# EasyEDA Pro project drive.epro, board PCB2
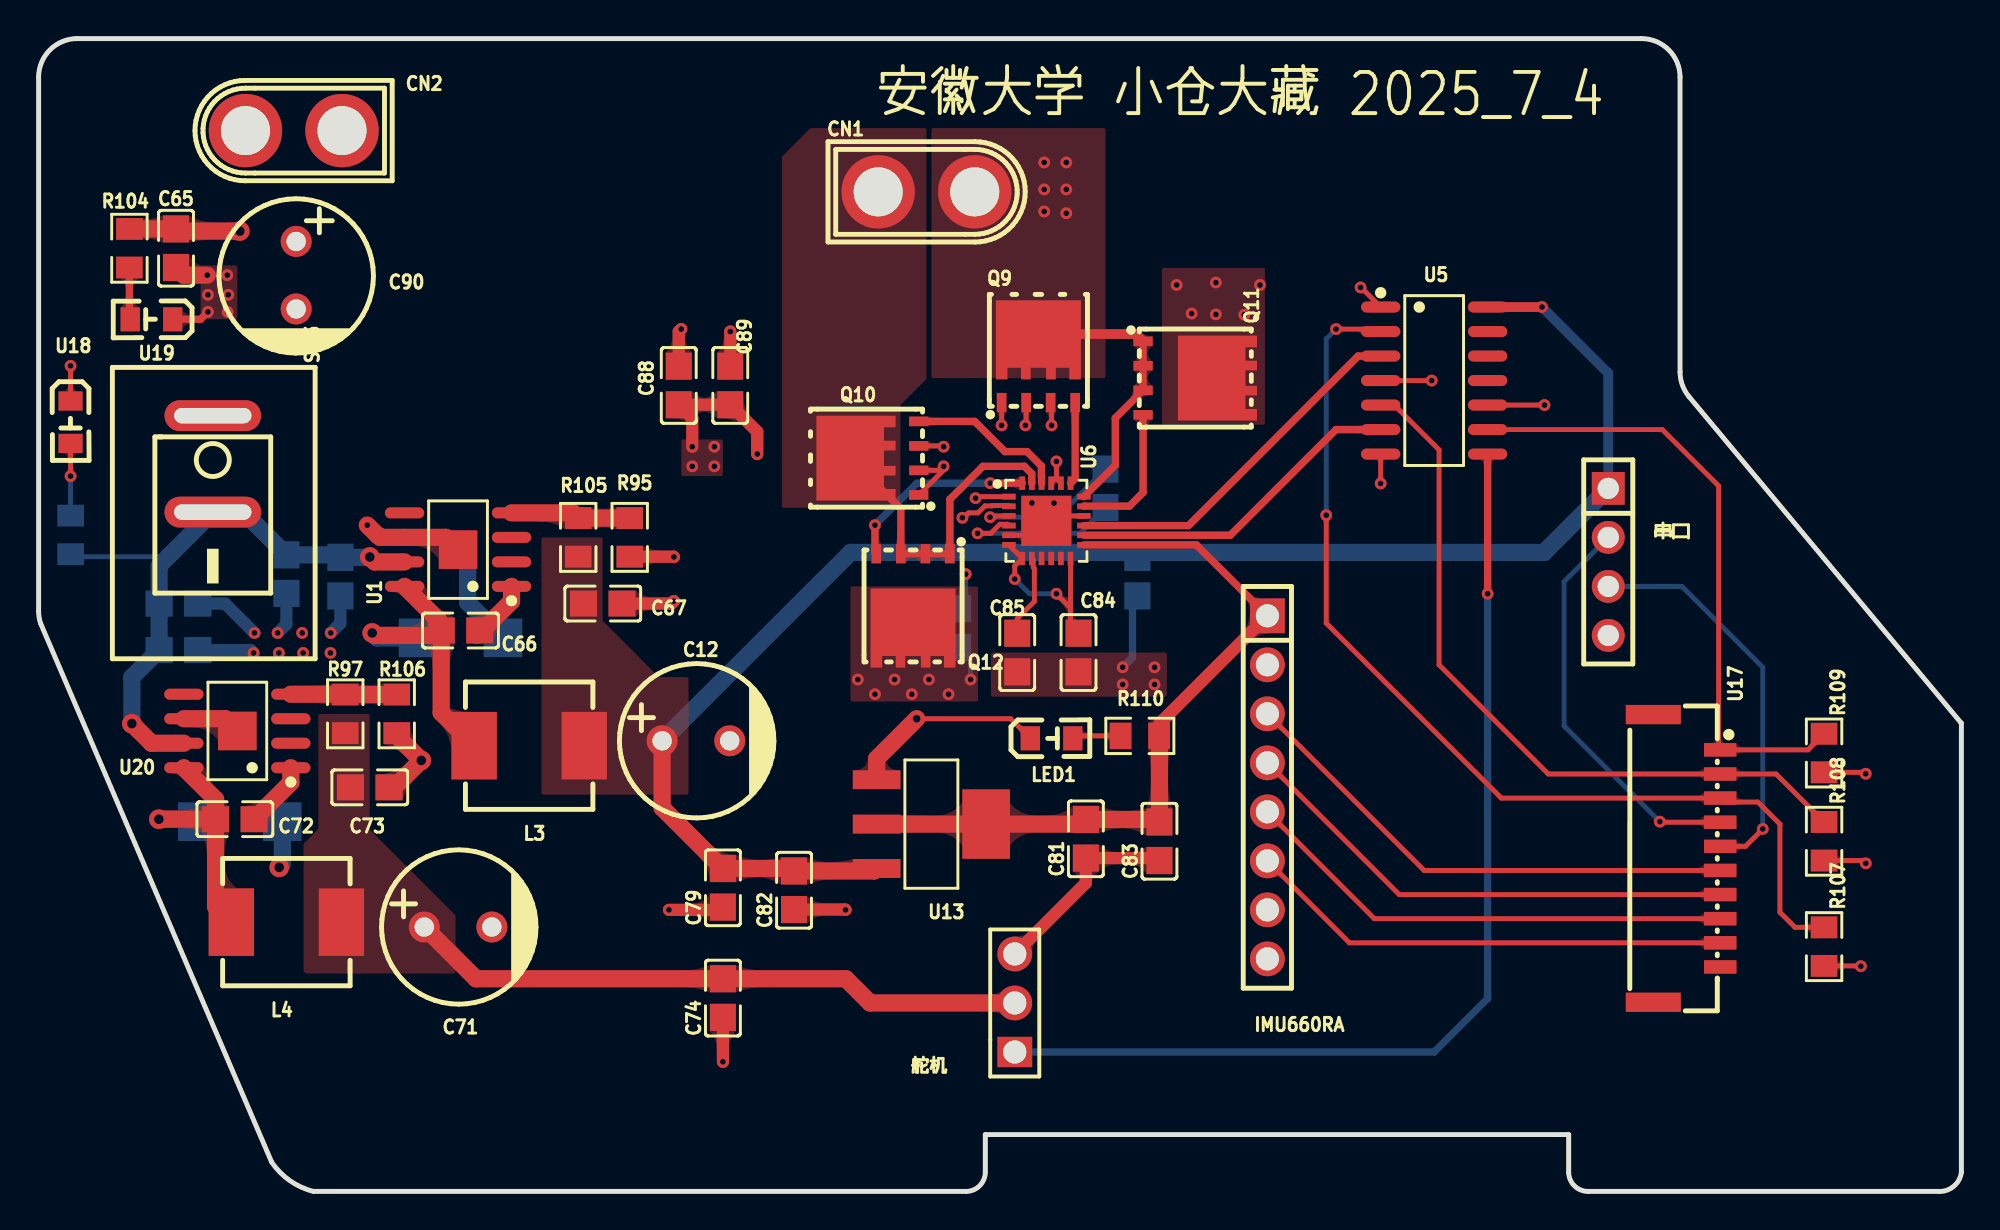
[diagram p4: board, top side]
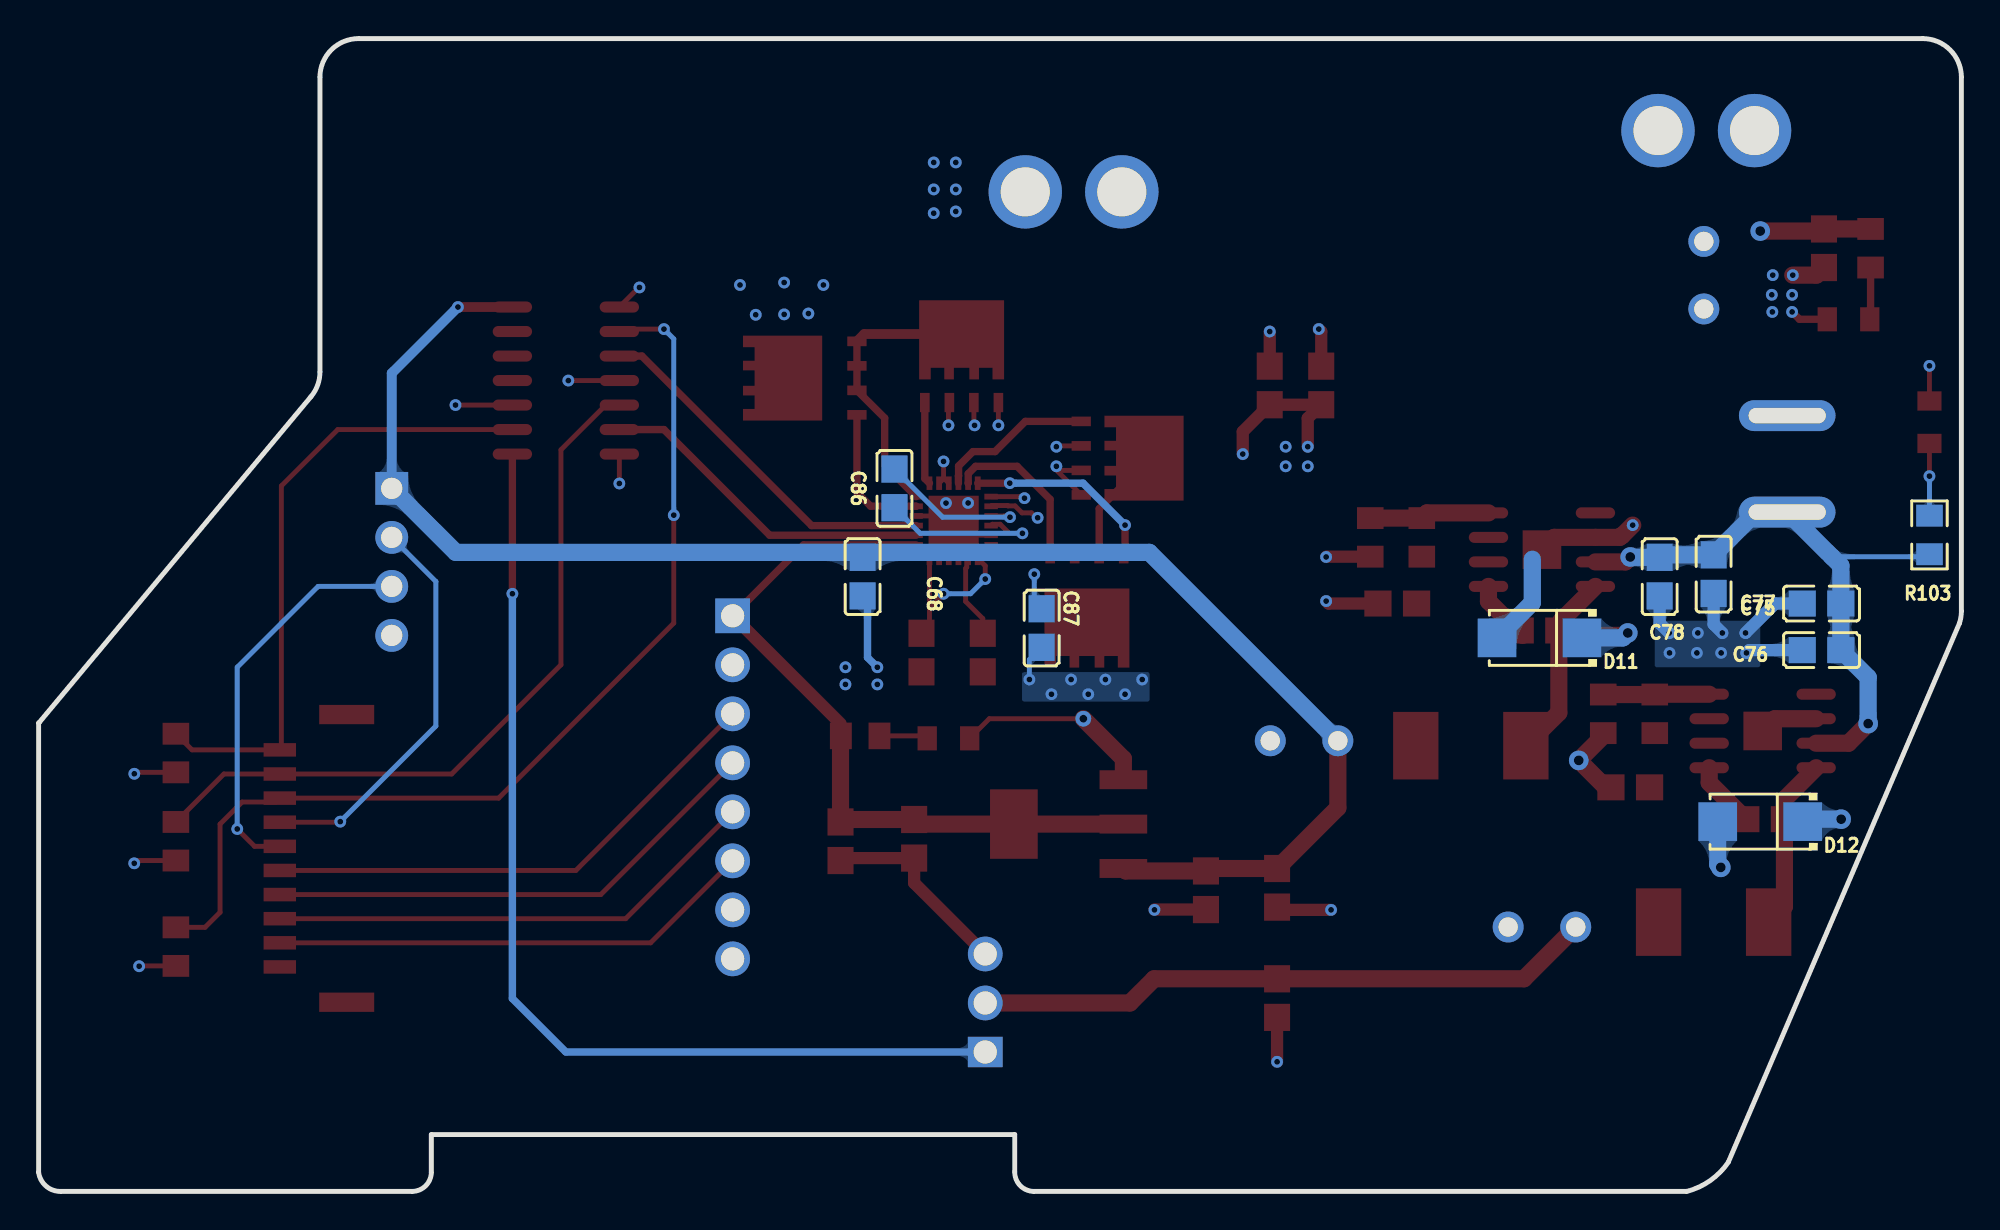
[diagram p5: board, bottom side, seen from below]

Outline 99.57 x 59.75 mm; copper layers: Top Layer, GND, PWR, Bottom Layer. Coordinates in mm from the lower left corner of the outline.
Outline path: 0,57.75 arc(0.59,59.16) 2,59.75 83,59.75 arc(84.41,59.16) 85,57.75 85,42.47 arc(85.12,41.79) 85.46,41.19 99.54,24.3 99.57,24.27 99.57,1 arc(99.19,0.28) 98.43,0 80.23,0 arc(79.53,0.29) 79.23,0.99 79.23,2.95 49.02,2.95 49.02,1 arc(48.73,0.29) 48.02,0 14.22,0 arc(13,0.56) 12.06,1.52 0.1,29.44 arc(0.03,29.75) 0,30.07 0,57.75
Stack: Top Layer 0.035mm 外层铜厚1oz / Dielectric1 0.2104mm 7628 RC49% 8.6mil / GND 0.0152mm 内层铜厚 / Dielectric2 1.065mm 1.1mm H/HOZ Copper / PWR 0.0152mm 内层铜厚 / Dielectric3 0.2104mm 7628 RC49% 8.6mil / Bottom Layer 0.035mm 外层铜厚1oz

## Design rules (mm)
template: 自定义配置
spacing copperThickness1oz (default): track to track 0.102, other pairs 0.152 to 0.3
spacing copperThickness2oz: track to track 0.203, other pairs 0.152 to 0.3
track width copperThickness1oz (default): min 0.127, default 0.254, max 2.54
track width copperThickness2oz: min 0.203, default 0.254, max 2.54
differential pair differentialPair (default): width min 0.127, default 0.254, max 2.54; gap min 0.152, default 0.152
via viaSize (default): diameter min 0.5, default 0.61, max 10; hole min 0.3, default 0.305, max 6.3
net PGND uses ALL
net VCC_5V uses ALL
net MVCC uses ALL
net VCC_12V uses ALL
net AOUT1 uses ALL
net AOUT2 uses ALL
net VCC_6_79V uses ALL

## Placement (name value [footprint] x y rotation side)
C12  220uF  [CAP-TH_BD8.0-P3.50-D0.6-FD]  34.04 23.35 0 top
C65  100nF  [C0805]  7.11 48.88 270 top
C66  10nF  [C0805]  21.85 29.07 180 top
C67  100nF  [C0805]  29.21 30.47 180 top
C68  100nF  [C0805]  56.9 31.86 90 bottom
C71  220uF  [CAP-TH_BD8.0-P3.50-D0.6-FD]  21.72 13.7 0 top
C72  10nF  [C0805]  10.16 19.29 180 top
C73  100nF  [C0805]  17.15 20.94 180 top
C74  100nF  [C0805]  35.44 10.02 90 top
C75  10uF  [C0805]  7.24 30.47 180 bottom
C76  10uF  [C0805]  7.24 28.05 180 bottom
C77  10uF  [C0805]  12.83 31.99 90 bottom
C78  10uF  [C0805]  15.62 31.86 90 bottom
C79  10uF  [C0805]  35.44 15.73 90 top
C81  10uF  [C0805]  54.23 18.27 90 top
C82  100nF  [C0805]  39.12 15.61 90 top
C83  100nF  [C0805]  58.04 18.15 90 top
C84  1uF  [C0805]  53.85 27.93 90 top
C85  1uF  [C0805]  50.68 27.93 90 top
C86  100nF  [C0805]  55.25 36.44 270 bottom
C87  1uF  [C0805]  47.63 29.2 270 bottom
C88  100nF  [C0805]  33.15 41.77 270 top
C89  10uF  [C0805]  35.82 41.77 270 top
C90  470uF  [CAP-TH_BD8.0-P3.50-D0.6-FD]  13.34 47.48 270 top
CN1  XT30U-M  [CONN-TH_XT30U-M]  45.98 51.8 0 top
CN2  XT30U-M  [CONN-TH_XT30U-M]  13.21 54.98 180 top
D11  SS34  [SMA_L4.3-W2.6-LS5.2-RD]  21.85 28.69 0 bottom
D12  SS34  [SMA_L4.3-W2.6-LS5.2-RD]  10.42 19.16 0 bottom
IMU660RA  2.54-1*8P母环保  [HDR-TH_8P-P2.54-V-F-1]  63.63 20.94 270 top
L3  15uH  [IND-SMD_L7.2-W6.6_GPSR07X0]  25.4 23.1 0 top
L4  15uH  [IND-SMD_L7.2-W6.6_GPSR07X0]  12.83 13.96 0 top
LED1  YLED0805R  [LED0805-RD]  52.45 23.48 0 top
Q9  TPH1R403NL  [POWERVDFN-8_L6.2-W5.2-P1.27-LS6.0-BL]  51.77 42.66 0 top
Q10  TPH1R403NL  [POWERVDFN-8_L6.2-W5.2-P1.27-LS6.0-BL]  43.8 38 90 top
Q11  TPH1R403NL  [POWERVDFN-8_L6.2-W5.2-P1.27-LS6.0-BL]  58.97 42.15 270 top
Q12  TPH1R403NL  [POWERVDFN-8_L6.2-W5.2-P1.27-LS6.0-BL]  45.28 31.27 180 top
R95  3.24kΩ  [R0805]  30.61 33.9 90 top
R97  43kΩ  [R0805]  15.88 24.75 270 top
R103  10kΩ  [R0805]  1.65 34.02 90 bottom
R104  10kΩ  [R0805]  4.7 48.88 270 top
R105  10kΩ  [R0805]  27.94 33.9 270 top
R106  10kΩ  [R0805]  18.54 24.75 90 top
R107  10kΩ  [R0805]  92.46 12.69 270 top
R108  10kΩ  [R0805]  92.46 18.15 270 top
R109  10kΩ  [R0805]  92.46 22.72 270 top
R110  10kΩ  [R0805]  57.03 23.61 180 top
SW3  KCD11-2P-R  [SW-TH_2P-L15.0-W10.5-P5.00_KCD11-2P-R]  9.02 37.71 270 top
U1  TPS5430DDAR  [SOIC-8_L5.0-W4.0-P1.27-LS6.0-BL-EP2.0]  21.72 33.26 90 top
U5  SN74HC125DR  [SOIC-14_L8.7-W3.9-P1.27-LS6.0-BL]  72.27 42.02 270 top
U6  DRV8701ERGET  [VQFN-24_L4.0-W4.0-P0.50-BL-EP2.5]  52.19 34.76 270 top
U13  AMS1117-3.3  [SOT-223-4_L6.5-W3.5-P2.30-LS7.0-BR]  46.23 19.04 180 top
U17  HC-GH-10PLT  [CONN-SMD_10P-P1.25_HCTL_HC-GH-10PLT]  85.35 17.26 270 top
U18  YLED0805R  [LED0805-RD]  1.65 39.86 270 top
U19  YLED0805R  [LED0805-RD]  5.84 45.2 180 top
U20  TPS5430DDAR  [SOIC-8_L5.0-W4.0-P1.27-LS6.0-BL-EP2.0]  10.29 23.86 90 top
串口  2.54-1*4P母  [HDR-TH_4P-P2.54-V-F]  81.28 32.63 270 top
舵机  77311-102-03LF  [HDR-TH_3P-P2.54-V-M-1]  50.55 9.77 90 top

## Footprints (pads in the part's own frame, mm; a bottom-side part is the same pattern mirrored in y, then rotated)
C0805
  rect 1.41x1.35 smd: 1(-1,0) 2(1,0)
CAP-TH_BD8.0-P3.50-D0.6-FD
  round 1.6 hole 1: 1(-1.75,0) 2(1.75,0)
CONN-SMD_10P-P1.25_HCTL_HC-GH-10PLT
  rect 0.7x1.68 smd: 1(-5.625,1.732) 2(-4.375,1.732) 3(-3.125,1.732) 4(-1.875,1.732) 5(-0.625,1.732) 6(0.625,1.732) 7(1.875,1.732) 8(3.125,1.732) 9(4.375,1.732) 10(5.625,1.732)
  rect 1x2.85 smd: 11(7.455,-1.732) 12(-7.455,-1.732)
CONN-TH_XT30U-M
  round 3.8 hole 2.54: 1(-2.5,0) 2(2.5,0)
HDR-TH_3P-P2.54-V-M-1
  rect 1.575x1.8 hole 1.2: 1(-2.54,0)
  round 1.8 hole 1.2: 2(0,0) 3(2.54,0)
HDR-TH_4P-P2.54-V-F
  rect 1.7x1.7 hole 1.1: 1(-3.81,0)
  round 1.7 hole 1.1: 2(-1.27,0) 3(1.27,0) 4(3.81,0)
HDR-TH_8P-P2.54-V-F-1
  rect 1.8x1.8 hole 1.2: 1(-8.89,0)
  round 1.8 hole 1.2: 2(-6.35,0) 3(-3.81,0) 4(-1.27,0) 5(1.27,0) 6(3.81,0) 7(6.35,0) 8(8.89,0)
IND-SMD_L7.2-W6.6_GPSR07X0
  rect 2.35x3.5 smd: 1(-2.85,0) 2(2.85,0)
LED0805-RD
  rect 1x1.25 smd: 1(-1.1,0) 2(1.1,0)
POWERVDFN-8_L6.2-W5.2-P1.27-LS6.0-BL
  rect 0.5x1 smd: 1(-1.905,-1.775) 2(-0.635,-1.775) 3(0.635,-1.775) 4(1.905,-1.775)
  custom 4.4x4.1 smd: 5(0,1.775)
R0805
  rect 1.133x1.377 smd: 1(-1,0) 2(1,0)
SMA_L4.3-W2.6-LS5.2-RD
  rect 2x2 smd: 1(-2.2,0) 2(2.2,0)
SOIC-8_L5.0-W4.0-P1.27-LS6.0-BL-EP2.0
  oval 0.574x2.038 smd: 1(-1.905,-2.769) 2(-0.635,-2.769) 3(0.635,-2.769) 4(1.905,-2.769) 5(1.905,2.769) 6(0.635,2.769) 7(-0.635,2.769) 8(-1.905,2.769)
  rect 2x2 smd: 9(0,0)
SOIC-14_L8.7-W3.9-P1.27-LS6.0-BL
  oval 0.574x2.038 smd: 1(-3.81,-2.769) 2(-2.54,-2.769) 3(-1.27,-2.769) 4(0,-2.769) 5(1.27,-2.769) 6(2.54,-2.769) 7(3.81,-2.769) 8(3.81,2.769) 9(2.54,2.769) 10(1.27,2.769) 11(0,2.769) 12(-1.27,2.769) 13(-2.54,2.769) 14(-3.81,2.769)
SOT-223-4_L6.5-W3.5-P2.30-LS7.0-BR
  rect 2.47x0.98 smd: 1(2.835,-2.3) 2(2.835,0) 3(2.835,2.3)
  rect 2.47x3.6 smd: 4(-2.835,0)
SW-TH_2P-L15.0-W10.5-P5.00_KCD11-2P-R
  oval 1.6x5 hole 0.8x4: 1(-2.5,0) 2(2.5,0)
VQFN-24_L4.0-W4.0-P0.50-BL-EP2.5
  rect 0.3x0.7 smd: 1(-1.25,-1.942) 2(-0.75,-1.942) 3(-0.25,-1.942) 4(0.25,-1.942) 5(0.75,-1.942) 6(1.25,-1.942) 13(1.25,1.942) 14(0.75,1.942) 15(0.25,1.942) 16(-0.25,1.942) 17(-0.75,1.942) 18(-1.25,1.942)
  rect 0.7x0.3 smd: 7(1.948,-1.25) 8(1.948,-0.75) 9(1.948,-0.25) 10(1.948,0.25) 11(1.948,0.75) 12(1.948,1.25) 19(-1.948,1.25) 20(-1.948,0.75) 21(-1.948,0.25) 22(-1.948,-0.25) 23(-1.948,-0.75) 24(-1.948,-1.25)
  rect 2.6x2.6 smd: 25(0.001,-0.001)

## Nets
PGND: C12.2 C65.2 C67.1 C68.1 C71.2 C73.1 C74.1 C75.1 C76.1 C77.1 C78.1 C79.1 C81.1 C82.1 C83.1 C84.1 C85.1 C88.1 C89.1 C90.2 CN2.2 D11.2 D12.2 IMU660RA.2 LED1.1 Q9.1 Q9.2 Q9.3 Q10.1 Q10.2 Q10.3 R95.1 R106.1 R107.2 R108.2 R109.2 U1.6 U1.9 U5.1 U5.4 U5.7 U5.10 U6.5 U6.16 U6.20 U6.21 U6.25 U13.1 U18.1 U19.1 U20.6 U20.9 串口.4 舵机.3
VCC_3V: C81.2 C83.2 IMU660RA.1 R110.1 U6.13 U13.2 U13.4
VCC_5V: C12.1 C67.2 C68.2 C79.2 C82.2 L3.2 R105.2 U5.14 U13.3 串口.1
VCC_6_79V: C71.1 C73.2 C74.2 L4.2 R97.2 舵机.2
VCC_12V: C75.2 C76.2 C77.2 C78.2 C87.2 C88.2 C89.2 Q11.5 Q12.5 R103.1 SW3.2 U1.7 U6.1 U20.7
15.0: U17.10
AIN1: U5.3 U6.15
AIN2: U5.6 U6.14
AOUT1: CN1.1 Q10.5 Q12.1 Q12.2 Q12.3 U6.23
AOUT2: CN1.2 Q9.5 Q11.1 Q11.2 Q11.3 U6.18
MOTOR_DIR: R107.1 U5.2 U17.3
MVCC: C65.1 C90.1 CN2.1 R104.1 SW3.1
PIN_SERVO: R109.1 U5.9 U17.1
PIN_SPEED: R108.1 U5.5 U17.2
SERVO_SN74: U5.8 舵机.1
SPI_CS_PIN: IMU660RA.6 U17.9
SPI_MISO: IMU660RA.5 U17.8
SPI_MOSI: IMU660RA.4 U17.7
SPI_SCK: IMU660RA.3 U17.6
UART3_RX_P15_7: U17.5 串口.3
UART3_TX_P15_6: U17.4 串口.2
$1N771: R104.2 U19.2
$1N779: R103.2 U18.2
$1N1828: C66.2 D11.1 L3.1 U1.8
$1N1829: R95.2 R105.1 U1.4
$1N1832: C66.1 U1.1
$1N3138: C72.2 D12.1 L4.1 U20.8
$1N3145: R97.1 R106.2 U20.4
$1N3169: C72.1 U20.1
$1N4767: Q12.4 U6.24
$1N4768: Q10.4 U6.22
$1N4769: Q9.4 U6.19
$1N4771: Q11.4 U6.17
$1N4774: C84.2 U6.6 U6.7 U6.12
$1N4775: C85.2 U6.8
$1N4776: C86.2 U6.4
$1N4777: C86.1 U6.3
$1N4778: C87.1 U6.2
$1N6651: LED1.2 R110.2

Pads without a net: IMU660RA 7 8; U1 2 3 5; U5 11 12 13; U6 9 10 11; U17 11 12; U20 2 3 5

## Via types
v1: diameter 0.61, hole 0.305, Top Layer to Bottom Layer, 82 vias
v2: diameter 0.813, hole 0.406, Top Layer to Bottom Layer, 1 via
v3: diameter 1.016, hole 0.508, Top Layer to Bottom Layer, 7 vias

## Routing (per net, layer and track width the routed paths; a pad name or vN(x,y) marks a point on that pad's centre or on a via; arc(x,y) is an arc through that point)
PGND: length 105.1
  Top Layer w0.254: v1(68.46,46.85) 68.48,46.85 U5.1 ; Q10.2 46.65,37.37 v1(46.87,37.58) 46.87,37.39 Q10.1 ; R109.2 94.54,21.72 v1(94.61,21.64) ; Q9.1 v1(49.87,39.7) ; v1(52.45,39.7) 52.45,40.84 Q9.3 ; v1(94.36,11.67) 94.35,11.69 92.46,11.69 ; 52.71,36.98 52.71,36.93 52.94,36.71 ; 52.71,36.98 v1(52.71,37.83) ; 52.71,36.98 52.44,36.71 ; v1(46.87,38.59) 46.82,38.64 Q10.3 ; v1(51.1,39.7) 51.14,39.74 Q9.2 ; U5.4 v1(72.14,42.02) ; v1(94.62,17) 94.47,17.15 R108.2 ; v1(1.65,42.79) U18.1 ; U6.16 52.44,35.01 U6.25 51.44,34.01 U6.5 ; U5.10 v1(77.98,40.75) ; v2(45.47,24.5) 50.34,24.5 LED1.1 ; U5.7 v1(69.5,36.69)
  Top Layer w0.381: U19.1 8.38,45.2 v1(8.77,45.58)
  Top Layer w0.635: C82.1 41.77,14.61 v1(41.79,14.59) ; C88.1 33.15,44.56 v1(33.28,44.69) ; 舵机.3 54.23,15.99 C81.1 57.91,17.27 C83.1 ; R95.1 32.88,32.9 v1(32.9,32.88) ; v1(32.64,14.59) 35.29,14.59 C79.1 ; C89.1 v1(35.82,44.56) ; C74.1 v1(35.44,6.72) ; C67.1 32.77,30.47 v1(32.9,30.59)
  Top Layer w0.889: C73.1 18.42,20.94 v3(19.81,22.34) 18.54,23.61 R106.1 ; U13.1 43.4,22.42 v2(45.47,24.5) ; v1(8.73,47.49) 7.51,47.49 C65.2 ; v1(17.02,34.53) 17.57,33.98 17.61,33.98 17.69,33.9 U1.6 21.08,33.9 21.22,33.76 ; 9.79,24.36 9.65,24.5 U20.6
  Bottom Layer w0.381: v1(56.14,27.16) 56.64,27.67 56.64,30.61 C68.1
  Bottom Layer w0.635: C77.1 12.83,29.39 v1(12.38,28.94) ; C75.1 9.65,30.47 v1(11.18,28.94) ; v1(11.13,27.91) 10.98,28.05 C76.1 ; v1(15.13,28.94) 15.62,29.44 C78.1
  Bottom Layer w0.889: v3(12.46,16.79) 12.62,16.95 D12.2 ; D11.2 22.22,30.52 22.22,32.76
  vias: v1(8.77,46.47) v1(9.77,47.49) v1(9.82,46.47) v1(9.79,45.58) v1(12.44,27.91) v1(13.65,28.94) v1(13.7,27.91) v1(15.11,27.91) v1(51.44,35.68) v1(52.58,35.67) v1(56.14,26.28) v1(57.79,27.16) v1(57.79,26.28)
VCC_3V: length 38.8
  Top Layer w0.381: U6.13 59.95,33.51 IMU660RA.1 ; R110.1 58.04,23.62 58.04,24.24
  Top Layer w0.635: 58.04,24.24 IMU660RA.1
  Top Layer w0.889: U13.2 U13.4 53.99,19.04 C81.2 57.91,19.27 C83.2 58.04,23.59 R110.1
VCC_5V: length 84
  Top Layer w0.508: U5.14 v1(77.85,45.83)
  Top Layer w0.889: C12.1 32.29,19.88 C79.2 38.99,16.73 C82.2 43.27,16.61 U13.3
  Bottom Layer w0.508: 串口.1 81.28,42.4 v1(77.85,45.83)
  Bottom Layer w0.889: C12.1 42.05,33.12 77.96,33.12 串口.1
VCC_6_79V: length 32.2
  Top Layer w0.889: 舵机.2 43.06,9.77 41.8,11.02 C74.2 22.65,11.02 C71.1
VCC_12V: length 56.1
  Top Layer w0.254: U6.1 48.6,36.01 v1(48.52,35.93)
  Top Layer w0.635: v1(37.21,38.21) 37.21,39.37 C89.2 C88.2 33.85,40.07 v1(33.85,38.59)
  Top Layer w0.889: U20.7 5.84,23.23 v3(4.83,24.24) ; v3(17.15,32.88) 17.4,32.63 U1.7
  GND w0.635: v1(48.52,35.93) 39.5,35.93 v1(37.21,38.21)
  Bottom Layer w0.254: R103.1 1.78,32.89 6.71,32.89 ; C87.2 48.26,27.56 v1(48.26,26.53)
  Bottom Layer w0.889: v3(17.15,32.88) 17.13,32.86 C78.2 15.5,32.99 C77.2 10.61,35.21 SW3.2 6.24,32.43 C75.2 C76.2 4.83,26.64 v3(4.83,24.24)
  vias: v1(33.85,37.58) v1(34.99,38.59) v1(34.99,37.58) v1(42.42,26.53) v1(43.31,25.77) v1(44.33,26.53) v1(45.21,25.77) v1(46.1,26.53) v1(47.12,25.77) v1(58.93,46.98) v1(59.71,45.5) v1(60.96,47.1) v1(60.96,45.45) v1(62.43,45.43) v1(63.25,46.98)
AIN1: length 19
  Top Layer w0.381: U5.3 68.33,43.29 59.54,34.51 U6.15
AIN2: length 17.6
  Top Layer w0.381: U5.6 67.19,39.48 61.71,34.01 U6.14
AOUT1: length 17
  Top Layer w0.381: Q10.5 44.65,35.38 Q12.3 Q12.2 Q12.1 47.19,35.87 48.9,37.58 51.05,37.58 51.43,37.2 51.43,36.71 51.44,36.71
AOUT2: length 14.9
  Top Layer w0.381: U6.18 55.76,37.63 55.76,40.08 Q11.3 Q11.2 Q11.1
  Top Layer w0.508: Q11.1 56.82,44.43 Q9.5
  vias: v1(52.07,53.33) v1(52.07,51.93) v1(52.07,50.79) v1(53.22,53.33) v1(53.22,51.93) v1(53.22,50.7)
MOTOR_DIR: length 52.8
  Top Layer w0.254: v1(66.68,35.05) 66.68,29.45 75.74,20.38 U17.3 87.28,20.18 89.03,20.18 90.17,19.04 90.17,14.46 90.95,13.69 R107.1 ; v1(67.19,44.69) 69.37,44.69 U5.2
  Bottom Layer w0.254: v1(66.68,35.05) 66.68,44.18 v1(67.19,44.69)
MVCC: length 26.4
  Top Layer w0.889: v3(10.42,49.77) 7.23,49.77 C65.1 R104.1
  PWR w0.889: v3(10.42,49.77) 10.95,49.23 C90.1 ; C90.1 11.31,47.2 11.31,42.49 SW3.1 ; C90.1 15.71,51.61 CN2.1
PIN_SERVO: length 32.6
  Top Layer w0.254: R109.1 91.62,22.88 U17.1 87,22.97 87,36.56 84.08,39.48 U5.9
PIN_SPEED: length 38.4
  Top Layer w0.254: U5.5 70.2,40.75 72.52,38.43 72.52,27.29 78.18,21.63 U17.2 89.97,21.63 R108.1
SERVO_SN74: length 53.9
  Top Layer w0.381: U5.8 v1(75.03,30.97)
  Bottom Layer w0.381: v1(75.03,30.97) 75.03,9.99 72.27,7.23 舵机.1
SPI_CS_PIN: length 25.2
  Top Layer w0.254: U17.9 67.88,12.88 IMU660RA.6
SPI_MISO: length 25.7
  Top Layer w0.254: U17.8 69.17,14.13 IMU660RA.5
SPI_MOSI: length 26.3
  Top Layer w0.254: IMU660RA.4 70.46,15.38 U17.7
SPI_SCK: length 26.8
  Top Layer w0.254: IMU660RA.3 71.75,16.63 U17.6
UART3_RX_P15_7: length 20.7
  Top Layer w0.254: U17.5 88.38,17.88 v1(89.28,18.78)
  Bottom Layer w0.254: 串口.3 85.09,31.36 89.28,27.16 v1(89.28,18.78)
UART3_TX_P15_6: length 20.9
  Top Layer w0.254: v1(83.95,19.16) 83.98,19.13 U17.4
  Bottom Layer w0.254: 串口.2 79,31.61 79,24.12 v1(83.95,19.16)
$1N771: length 2.7
  Top Layer w0.381: U19.2 4.7,45.24 R104.2
$1N779: length 3.7
  Top Layer w0.254: v1(1.65,37.07) 1.65,38.76
  Bottom Layer w0.254: R103.2 v1(1.65,37.07)
$1N1828: length 15.9
  Top Layer w0.889: v3(17.27,28.94) 17.4,28.82 20.72,28.82 20.72,29.59 U1.8 ; C66.2 20.85,24.81 L3.1
  Bottom Layer w0.889: v3(17.27,28.94) 17.53,28.69 D11.1
$1N1829: length 6.2
  Top Layer w0.889: R95.2 R105.1 27.67,35.17 U1.4
$1N1832: length 3.3
  Top Layer w0.889: U1.1 24.49,30.58 22.72,28.82
$1N3138: length 14
  Top Layer w0.889: L4.1 9.16,14.77 C72.2 ; C72.2 v3(6.23,19.29) ; C72.2 9.16,20.32 U20.8
  Bottom Layer w0.889: D12.1 8.09,19.29 v3(6.23,19.29)
$1N3145: length 5.5
  Top Layer w0.889: U20.4 15.86,25.77 R97.1 R106.2
$1N3169: length 3.5
  Top Layer w0.889: C72.1 13.06,21.19 U20.1
$1N4767: length 10
  Top Layer w0.381: Q12.4 43.31,33.12 v1(43.31,34.53) ; 50.94,36.71 v1(49.28,36.71)
  Bottom Layer w0.381: v1(49.28,36.71) 45.48,36.71 v1(43.31,34.53)
$1N4768: length 8.2
  Top Layer w0.381: 51.94,36.71 51.94,37.08 51.93,37.09 51.93,37.59 51.18,38.34 50.04,38.34 48.47,39.91 Q10.4
$1N4769: length 4.3
  Top Layer w0.381: 53.44,36.71 53.68,36.95 Q9.4
$1N4771: length 7.4
  Top Layer w0.381: Q11.4 57.19,36.22 56.48,35.51 54.14,35.51 U6.17
$1N4774: length 9.9
  Top Layer w0.254: 53.44,32.81 53.44,30.23 ; 53.44,30.23 53.44,29.23 53.85,28.82 ; 53.44,30.23 52.71,30.96 v1(52.71,30.97) ; v1(50.55,31.74) 50.55,32.42 50.94,32.81 50.25,33.5 U6.6
  Bottom Layer w0.254: v1(50.55,31.74) 51.31,30.97 v1(52.71,30.97)
$1N4775: length 4.3
  Top Layer w0.254: C85.2 50.68,29.69 51.56,30.58 51.56,32.29 51.51,32.34 51.51,32.74 51.44,32.81
$1N4776: length 9
  Top Layer w0.254: v1(48.62,34.11) 49.31,34.11 49.78,34.58 50.17,34.58 U6.4
  Bottom Layer w0.254: C86.2 53.92,34.11 v1(48.62,34.11)
$1N4777: length 8
  Top Layer w0.254: U6.3 49.56,35.01 49.5,34.94 v1(49.27,34.94)
  Bottom Layer w0.254: C86.1 52.76,34.94 v1(49.27,34.94)
$1N4778: length 7.6
  Top Layer w0.254: U6.2 50.2,35.55 49.39,35.55 49.37,35.53 49.01,35.53 48.64,35.17 48.16,35.17 47.9,34.91 v1(47.84,34.91)
  PWR w0.254: v1(48.01,31.99) 47.84,32.16 v1(47.84,34.91)
  Bottom Layer w0.254: C87.1 48.01,30.58 v1(48.01,31.99)
$1N6651: length 2.5
  Top Layer w0.254: R110.2 53.68,23.61 LED1.2

## Copper pours and planes (outline as drawn; the poured copper is in the pictures)
PGND on Top Layer: 8.38,47.99 10.29,47.99 10.29,45.2 8.38,45.2
PGND on Top Layer: 49.31,27.93 58.42,27.93 58.42,25.64 49.31,25.64
PGND on Bottom Layer: 10.42,29.58 15.88,29.58 15.88,27.16 10.42,27.16
PGND on GND: 7.88,57.77 13.2,57.77 13.2,52.52 7.88,52.52
PGND on GND: -8.25,66.53 112.65,66.53 112.65,-5.09 -8.25,-5.09
VCC_5V on Top Layer: 26.04,20.56 33.66,20.56 33.66,26.66 32.12,26.66 29.21,29.56 29.21,33.9 26.16,33.9 26.04,34.02
VCC_6_79V on Top Layer: 17.14,24.75 17.14,18.76 21.59,14.31 21.59,11.29 13.85,11.29 13.72,11.42 13.72,18.02 14.48,18.78 14.48,24.75
VCC_12V on Top Layer: 58.17,47.87 63.5,47.87 63.5,39.74 58.17,39.74
VCC_12V on Top Layer: 33.28,38.98 35.44,38.98 35.44,37.07 33.28,37.07
VCC_12V on Top Layer: 42.04,31.36 48.64,31.36 48.64,25.39 42.04,25.39
VCC_12V on Bottom Layer: 42.04,26.91 48.64,26.91 48.64,25.39 42.04,25.39
VCC_12V on PWR: -3.93,60.31 102.75,60.31 102.75,-1.66 -3.93,-1.66
AOUT1 on Top Layer: 45.85,55.1 45.98,55.23 45.98,42.1 44.63,40.75 44.63,35.67 44.38,35.42 38.48,35.42 38.48,53.62 39.97,55.1
AOUT2 on Top Layer: 46.23,55.1 55.25,55.1 55.25,42.15 46.23,42.15
MVCC on PWR: 5.46,42.15 12.45,42.15 12.45,38.59 5.46,38.59
MVCC on PWR: 13.2,57.58 18.69,57.58 18.69,52.38 13.2,52.38

Small or netless copper shapes (teardrops, artwork), in the pictures only: 180 on Top Layer, 56 on Bottom Layer, 7 on PWR

## Text on the board
Top Silkscreen Layer: 安徽大学 小仓大藏 2025_7_4
